# Altium schematic sheet Sheet3.SchDoc
size A3
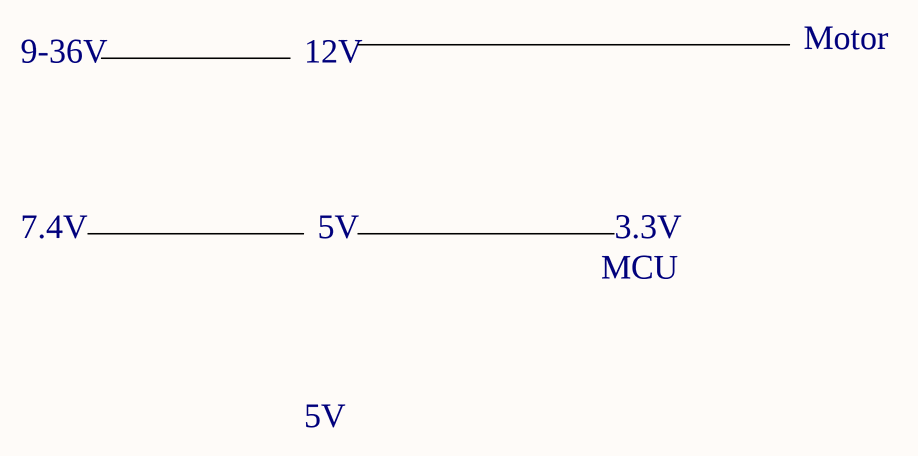
[diagram p0: Sheet3.SchDoc]

## Notes on the sheet
- 9-36V
- 12V
- Motor
- 7.4V
- 5V
- MCU
- 3.3V